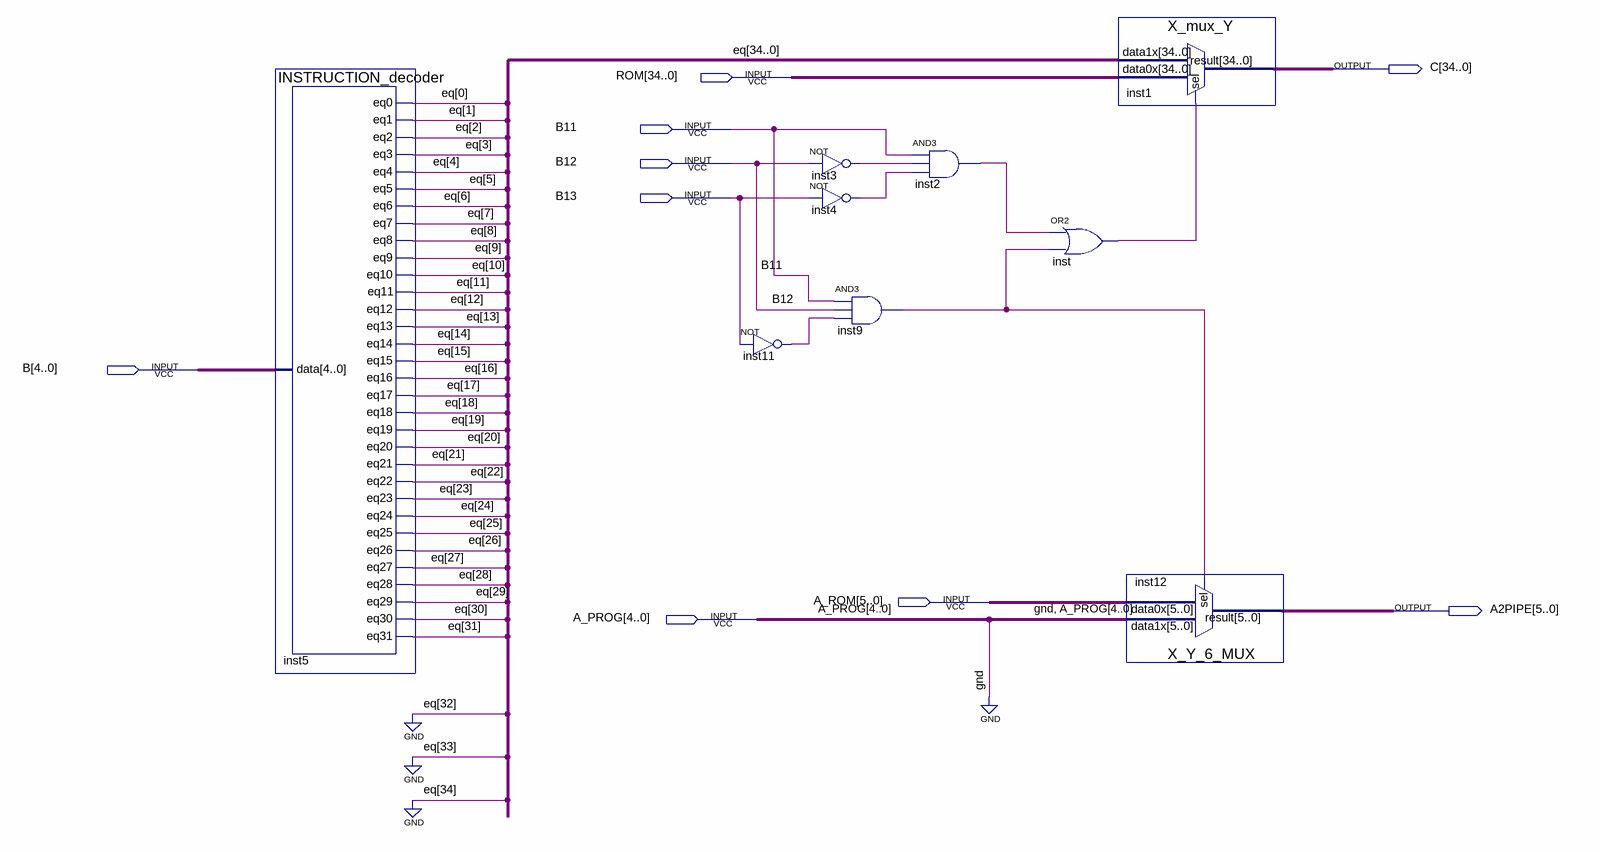
[diagram p0: schematic sheet]
// Quartus schematic XY_mux.bdf as structural Verilog: 9 symbols, 9 pins
module XY_mux (
  input  [34:0] ROM,
  input  B11,
  input  B12,
  input  B13,
  input  [4:0] B,
  input  [5:0] A_ROM,
  input  [4:0] A_PROG,
  output [34:0] C,
  output [5:0] A2PIPE
);

  wire inst2_out, inst3_out, inst4_out, inst9_out, inst11_out, inst_out;
  wire [31:0] eq;

  INSTRUCTION_decoder inst5 (
    .data(B), .eq0(eq[0]), .eq1(eq[1]), .eq2(eq[2]), .eq3(eq[3]), .eq4(eq[4]), .eq5(eq[5]), .eq6(eq[6]),
    .eq7(eq[7]), .eq8(eq[8]), .eq9(eq[9]), .eq10(eq[10]), .eq11(eq[11]), .eq12(eq[12]), .eq13(eq[13]),
    .eq14(eq[14]), .eq15(eq[15]), .eq16(eq[16]), .eq17(eq[17]), .eq18(eq[18]), .eq19(eq[19]), .eq20(eq[20]),
    .eq21(eq[21]), .eq22(eq[22]), .eq23(eq[23]), .eq24(eq[24]), .eq25(eq[25]), .eq26(eq[26]), .eq27(eq[27]),
    .eq28(eq[28]), .eq29(eq[29]), .eq30(eq[30]), .eq31(eq[31]));
  not inst11 (inst11_out, B13);
  not inst3 (inst3_out, B12);
  not inst4 (inst4_out, B13);
  and inst9 (inst9_out, B11, B12, inst11_out);
  and inst2 (inst2_out, B11, inst3_out, inst4_out);
  or inst (inst_out, inst2_out, inst9_out);
  X_mux_Y inst1 (.data1x({3'b000, eq}), .data0x(ROM), .sel(inst_out), .result(C));
  X_Y_6_MUX inst12 (.data1x({1'b0, A_PROG}), .data0x(A_ROM), .sel(inst9_out), .result(A2PIPE));
endmodule
